# EAGLE design AP CAPSTONE (EAGLE 9.3.0)
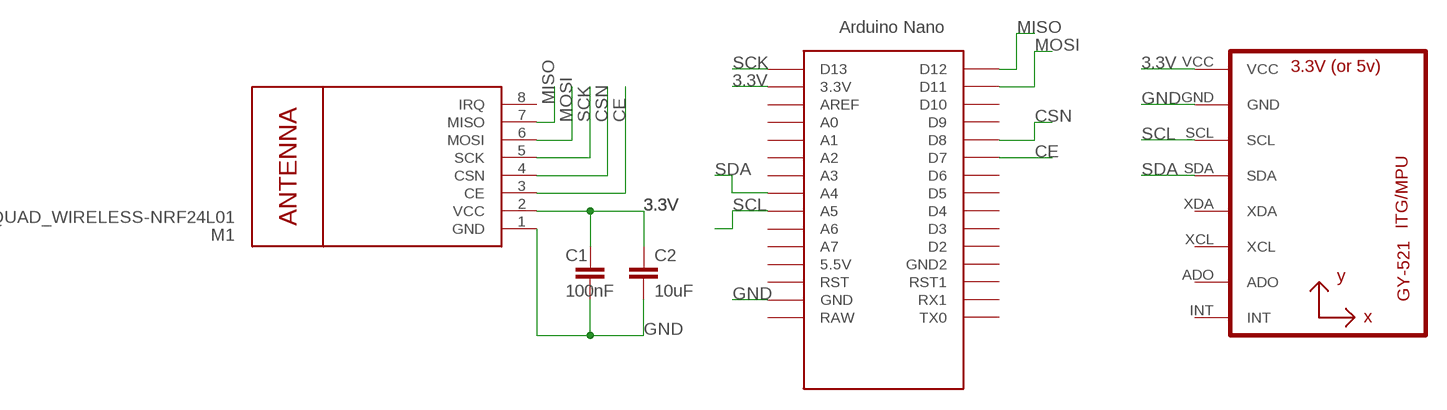
[diagram p0: schematic, sheet 1]

## Parts
C1  100nF  RCL_C-EUC1206  [RCL_C1206]
C2  10uF  RCL_C-EUC1206  [RCL_C1206]
M1  QUAD_WIRELESS-NRF24L01  [QUAD_WIRELESS-NRF24L01]
U1  QUAD_GY-521MPU6050  [QUAD_GY-521]
U$1  ARDUINO-CLONE_NANO  [ARDUINO-CLONE_NANO]

## Nets
3.3V: C1.1 C2.1 M1.2(VCC) U1.VCC U$1.3.3V
CE: M1.3(CE) U$1.D7
CSN: M1.4(CSN) U$1.D8
GND: C1.2 C2.2 M1.1(GND) U1.GND U$1.GND
MISO: M1.7(MISO) U$1.D12
MOSI: M1.6(MOSI) U$1.D11
SCK: M1.5(SCK) U$1.D13
SCL: U1.SCL U$1.A5
SDA: U1.SDA U$1.A4
Unconnected: M1.8(IRQ) U1.ADO U1.INT U1.XCL U1.XDA U$1.5V(5.5V) U$1.A0 U$1.A1 U$1.A2 U$1.A3 U$1.A6 U$1.A7 U$1.AREF U$1.D2 U$1.D3 U$1.D4 U$1.D5 U$1.D6 U$1.D9 U$1.D10 U$1.GND1(GND2) U$1.ICSP1 U$1.ICSP2 U$1.ICSP3 U$1.ICSP4 U$1.ICSP5 U$1.ICSP6 U$1.RAW U$1.RST U$1.RST1 U$1.RX1 U$1.TX0

## Library data of the parts
C1 C2 = capstone:RCL_C-EU: CAPACITOR, European symbol; SPICEPREFIX: C
M1 = capstone:QUAD_WIRELESS-NRF24L01: 2.4 GHz Wireless Module based on NRF24L01 chip
U1 = capstone:QUAD_GY-521
U$1 = capstone:ARDUINO-CLONE_NANO: Arduino Nano

## Board
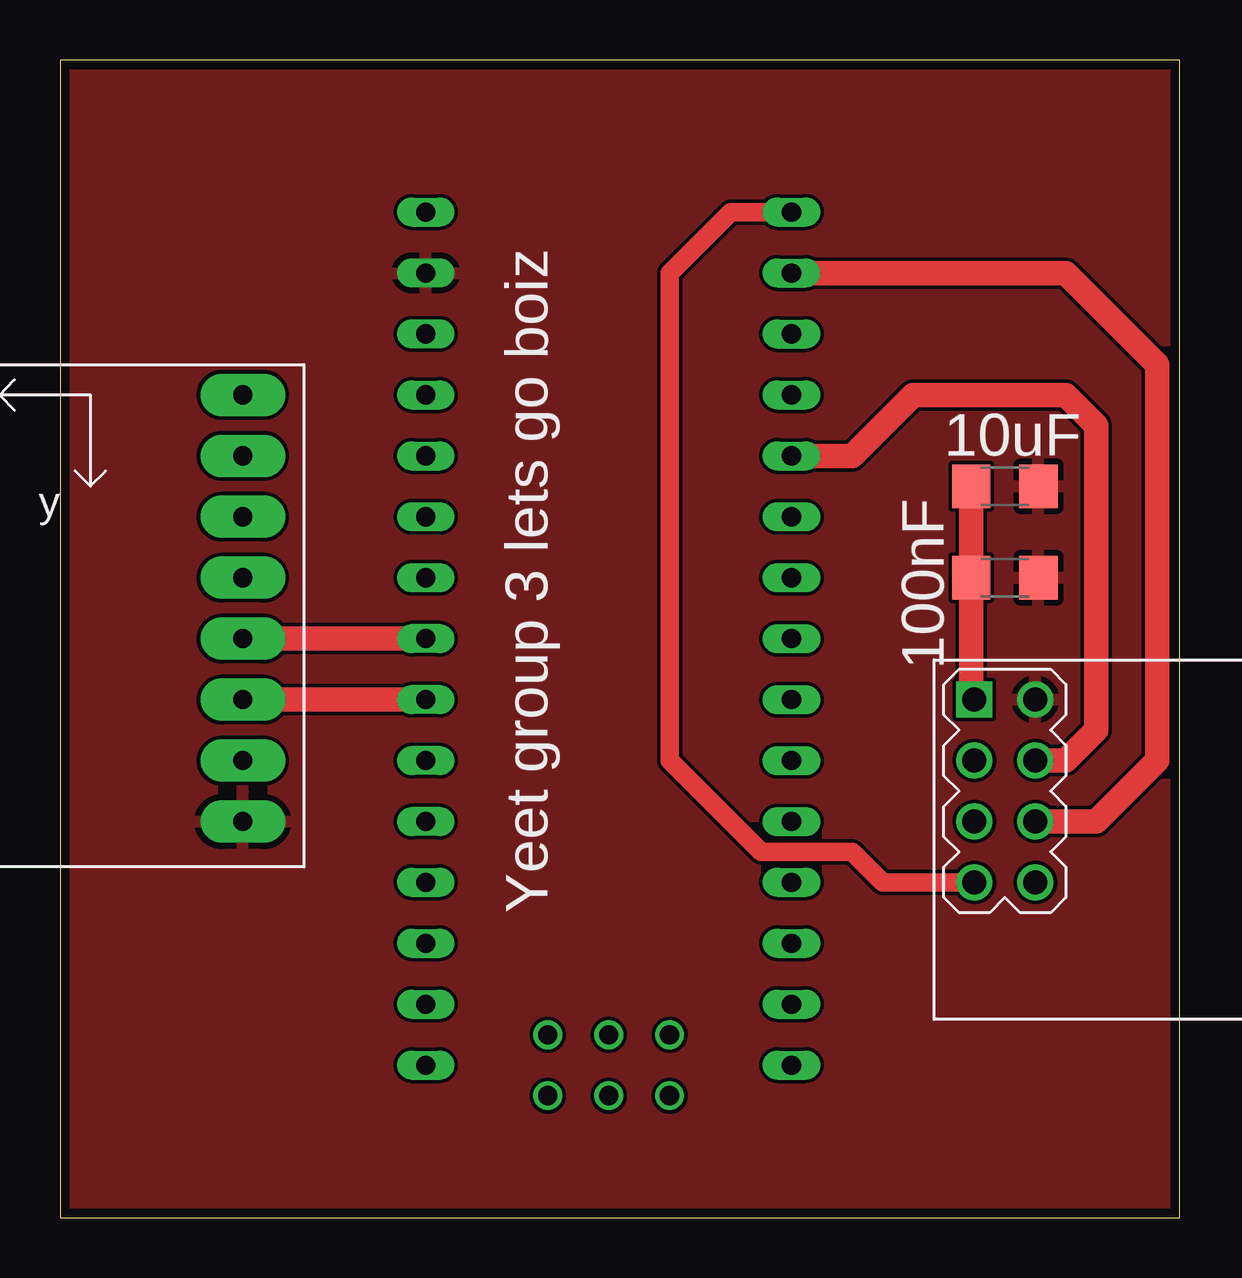
[diagram p1: board, top side]
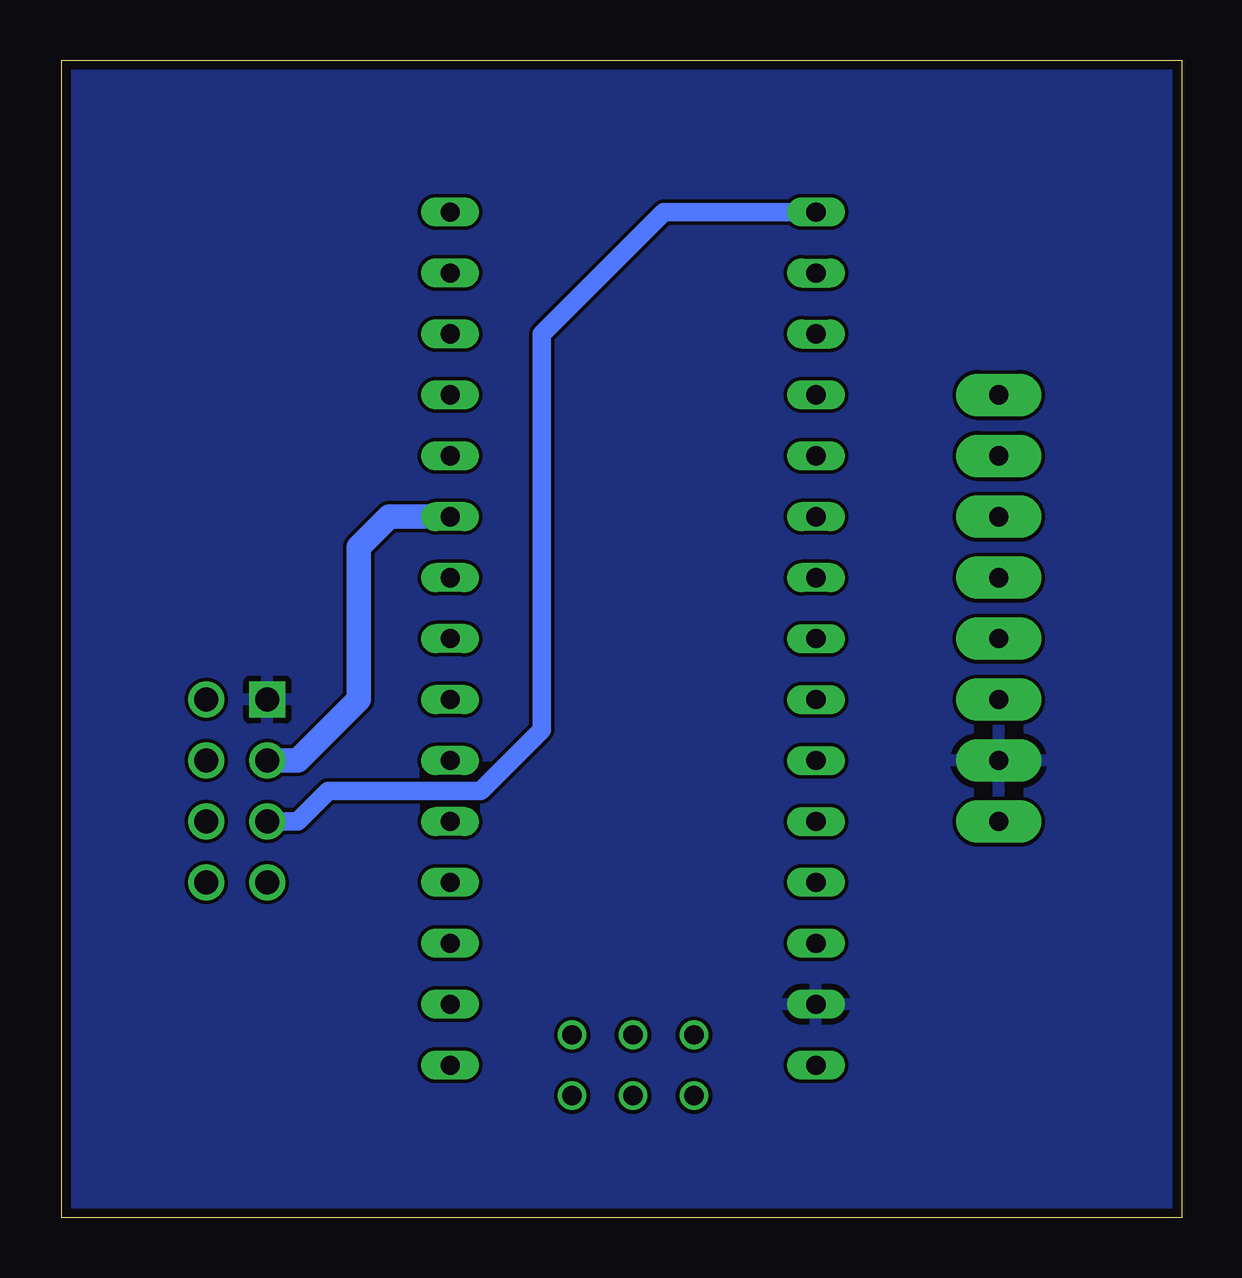
[diagram p2: board, bottom side, seen from below]

Size 46.66 x 48.25 mm. Coordinates in mm from the lower left corner, seen from the top.
Outline: 0,0 46.66,0 46.66,48.25 0,48.25 0,0
Copper layers (1*16): Top 0.035559375mm / dielectric 1.6mm / Bottom 0.035559375mm
Design rules "oshpark": minimum track width 6mil, minimum drill 10mil, track to track 6mil, track to pad 6mil, pad to pad 6mil, via to via 6mil, smd to smd 6mil, copper to edge 15mil, drill to drill 6mil, minimum pad ring 5mil, minimum via ring 5mil, stop-mask expansion 2.5mil, vias tented up to drill 0mil, thermal gap 10mil

### Footprints (pad centres in the part's own frame; a part is rotated, then mirrored left to right if it is on the bottom)
RCL_C1206 = smd 1.6 x 1.8: 1 -1.4,0; 2 1.4,0
QUAD_WIRELESS-NRF24L01 = drill 1 square: 1 -12.7,6.35 | drill 1: 2 -10.16,6.35; 3 -12.7,3.81; 4 -10.16,3.81; 5 -12.7,1.27; 6 -10.16,1.27; 7 -12.7,-1.27; 8 -10.16,-1.27
QUAD_GY-521 = drill 0.8 pad 1.778 long: ADO -8.89,-6.35; GND -8.89,6.35; INT -8.89,-8.89; SCL -8.89,3.81; SDA -8.89,1.27; VCC -8.89,8.89; XCL -8.89,-3.81; XDA -8.89,-1.27
ARDUINO-CLONE_NANO = drill 0.8 long: 3.3V -10.16,24.13; 5V -10.16,-1.27; A0 -10.16,19.05; A1 -10.16,16.51; A2 -10.16,13.97; A3 -10.16,11.43; A4 -10.16,8.89; A5 -10.16,6.35; A6 -10.16,3.81; A7 -10.16,1.27; AREF -10.16,21.59; D2 5.08,1.27; D3 5.08,3.81; D4 5.08,6.35; D5 5.08,8.89; D6 5.08,11.43; D7 5.08,13.97; D8 5.08,16.51; D9 5.08,19.05; D10 5.08,21.59; D11 5.08,24.13; D12 5.08,26.67; D13 -10.16,26.67; GND -10.16,-6.35; GND1 5.08,-1.27; RAW -10.16,-8.89; RST -10.16,-3.81; RST1 5.08,-3.81; RX1 5.08,-6.35; TX0 5.08,-8.89 | drill 0.8: ICSP1 -5.08,-10.16; ICSP2 -5.08,-7.62; ICSP3 -2.54,-10.16; ICSP4 -2.54,-7.62; ICSP5 0,-10.16; ICSP6 0,-7.62

### Placement (x,y rotation side)
C1  39.37,26.67 180 top
C2  39.37,30.48 180 top
M1  50.8,15.24 0 top
U1  -1.27,25.4 180 top
U$1  25.4,15.24 0 top

### Tracks (layer width: path | path; a pad name or v marks a point on that pad's centre or on a via)
3.3V
  pour Top: 0,48.26 46.99,48.26 46.99,0 0,0
CE
  Bottom 1.016: U$1.D7 33.02,29.21 34.29,27.94 34.29,21.59 36.83,19.05 M1.3
CSN
  Top 1.016: M1.4 41.91,19.05 43.18,20.32 43.18,33.02 41.91,34.29 35.56,34.29 33.02,31.75 U$1.D8
GND
  Top 1.016: C2.2 C1.2 37.97,21.72 M1.1
  pour Bottom: 0,48.26 46.99,48.26 46.99,0 0,0
MISO
  Top 0.762: M1.7 34.29,13.97 33.02,15.24 29.21,15.24 25.4,19.05 25.4,39.37 27.94,41.91 U$1.D12
MOSI
  Top 1.016: M1.6 43.18,16.51 45.72,19.05 45.72,35.56 41.91,39.37 U$1.D11
SCK
  Bottom 0.762: U$1.D13 21.59,41.91 26.67,36.83 26.67,20.32 29.21,17.78 35.56,17.78 36.83,16.51 M1.5
SCL
  Top 1.016: U1.SCL U$1.A5
SDA
  Top 1.016: U1.SDA U$1.A4

### Text on the board
tPlace: 10uF | 100nF | Yeet group 3 lets go boiz